# Altium schematic sheet [5] Charger.SchDoc: Charger
size A3; SheetNumber: 5; SheetTotal: 6
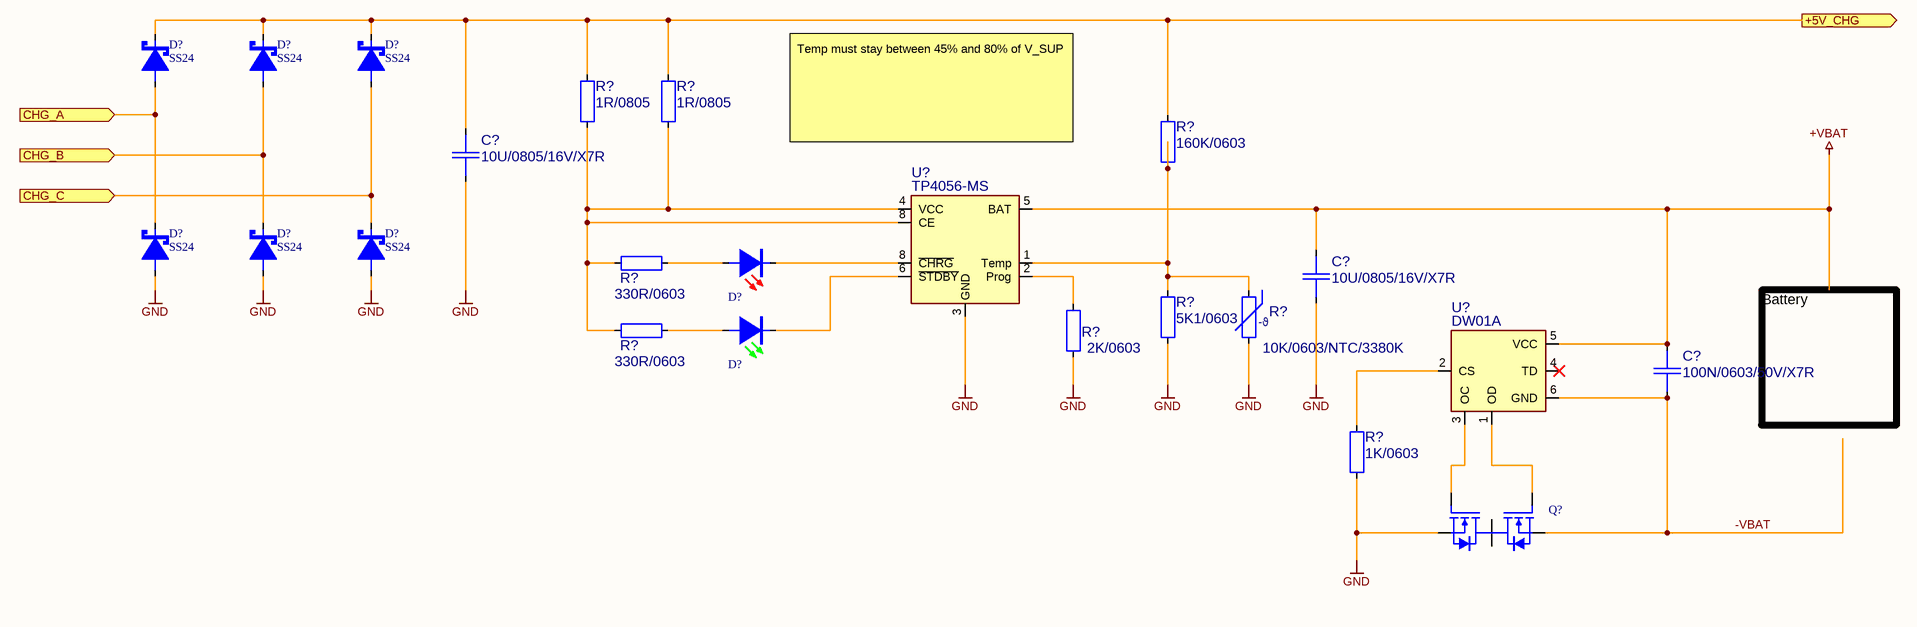
[diagram p0: [5] Charger.SchDoc]

## Parts
(Parts that share a designator on the sheet are numbered #1, #2 ... from top to bottom, then left to right.)
C?#1  10U/0805/16V/X7R  [CAP0805_X7R]
C?#2  10U/0805/16V/X7R  [CAP0805_X7R]
C?#3  100N/0603/50V/X7R  [CAP0603_X7R]
D?#1  SS24  [DIOM5226X230]
D?#2  SS24  [DIOM5226X230]
D?#3  SS24  [DIOM5226X230]
D?#4  SS24  [DIOM5226X230]
D?#5  SS24  [DIOM5226X230]
D?#6  SS24  [DIOM5226X230]
D?#7  LED Red  [LED0603_RED]  (value not drawn)
D?#8  LED Green  [LED0603_GREEN]  (value not drawn)
Q?  8205S  [SOT2395P280X125-3]  (value not drawn)
R?#1  1R/0805
R?#2  1R/0805
R?#3  160K/0603  [R0603-0.40-WW]
R?#4  330R/0603  [R0603-0.40-WW]
R?#5  5K1/0603  [R0603-0.40-WW]
R?#6  10K/0603/NTC/3380K  [R0603-0.40-WW]
R?#7  2K/0603  [R0603-0.40-WW]
R?#8  330R/0603  [R0603-0.40-WW]
R?#9  1K/0603
U?#1  TP4056-MS
U?#2  DW01A

## Ports
+5V_CHG (out), CHG_A (in), CHG_B (in), CHG_C (in)

## Nets
+VBAT: C?#2.1 C?#3.1 U?#1.5(BAT) U?#2.5(VCC)
GND: C?#1.2 C?#2.2 D?#4.2 D?#5.2 D?#6.2 Q?.1(SOURCE1) R?#5.2 R?#6.2 R?#7.2 R?#9.2 U?#1.3(GND)
+5V_CHG: C?#1.1 D?#1.1 D?#2.1 D?#3.1 R?#1.1 R?#2.1 R?#3.1 ; port +5V_CHG
-VBAT: C?#3.2 Q?.3(SOURCE2) U?#2.6(GND)
CHG_A: D?#1.2 D?#4.1 ; port CHG_A
CHG_B: D?#2.2 D?#5.1 ; port CHG_B
CHG_C: D?#3.2 D?#6.1 ; port CHG_C
NetD?#7_1: D?#7.1 U?#1.8(~{CHRG})
NetD?#7_2: D?#7.2 R?#4.2
NetD?#8_1: D?#8.1 U?#1.6(~{STDBY})
NetD?#8_2: D?#8.2 R?#8.2
NetQ?_4: Q?.4(GATE2) U?#2.1(OD)
NetQ?_6: Q?.6(GATE1) U?#2.3(OC)
NetR?#1_2: R?#1.2 R?#2.2 R?#4.1 R?#8.1 U?#1.4(VCC) U?#1.8(CE)
NetR?#3_2: R?#3.2 R?#5.1 R?#6.1 U?#1.1(Temp)
NetR?#7_1: R?#7.1 U?#1.2(Prog)
NetR?#9_1: R?#9.1 U?#2.2(CS)

Not connected (* = marked no-connect by the designer): Q? 5(DRAIN); U?#2 4(TD)*

## Notes on the sheet
- Temp must stay between 45% and 80% of V_SUP
- Battery
- Date:
- Size:
- A3
- Schema:
- Layout:
- (in symbol 10K/0603/NTC/3380K) -ϑ

## Library data of the parts
C?#1 C?#2 = 10U/0805/16V/X7R: CAP SM 0805 10uF 16V X7R; Manufacturer: GENERIC; Manufacturer 1: Cal-Chip Electronics, Inc.; Manufacturer Part Number 1: GMC21X7R106K16NT; Absolute Value: 1E-5; Part Number: 10U/0805/16V/X7R; Package: 805; Value: 10uF; HelpURL: https://88ce57.p3cdn1.secureserver.net/wp-content/uploads/2023/01/gmc_series-2.pdf; Supplier 1: Digi-Key; Supplier Part Number 1: 4713-GMC21X7R106K16NTCT-ND; Manufacturer 2: Samsung Electro-Mechanics; Manufacturer Part Number 2: CL21B106KOQNNNE; Supplier 2: Digi-Key; Supplier Part Number 2: 1276-2872-1-ND
C?#3 = 100N/0603/50V/X7R: CAP SM 0603 100nF 50V X7R; Manufacturer: GENERIC; Manufacturer 1: YAGEO; Manufacturer Part Number 1: CC0603KPX7R9BB104; Absolute Value: 1E-7; Part Number: 100N/0603/50V/X7R; Package: 603; Value: 100nF; HelpURL: https://www.yageo.com/upload/media/product/app/datasheet/mlcc/upy-gphc_x7r_6_3v-to-250v.pdf; Supplier 1: Digi-Key; Supplier Part Number 1: 311-3567-1-ND; Manufacturer 2: YAGEO; Manufacturer Part Number 2: CC0603MRX7R9BB104; Supplier 2: Digi-Key; Supplier Part Number 2: 311-4110-1-ND
D?#1-D?#6 = SS24: Si Shottky Diode 2A DO-214AC; Manufacturer: MSKSEMI; Manufacturer Part Number 1: SS24-MS; Absolute Value: 40V; Part Number: SS24; Package: DO-214AC, SMA; Value: SS24; HelpURL: https://datasheet.lcsc.com/lcsc/2202131930_MSKSEMI-SS24-MS_C2836395.pdf; Manufacturer 1: MSKSEMI; Supplier 1: LCSC.com; Supplier Part Number 1: C2836395; Manufacturer 2: ElecSuper; Manufacturer Part Number 2: SS24; Supplier 2: LCSC.com; Supplier Part Number 2: C7509566
D?#7 = LED Red: Generic LED Red; Manufacturer 1: Würth; Manufacturer Part Number 1: 150060RS75000; Part Number: LED Red; Manufacturer: GENERIC; Package: 603; Value: Red; Absolute Value: Red; HelpURL: https://www.we-online.com/katalog/datasheet/150060RS75000.pdf; Supplier 1: Digi-Key; Supplier Part Number 1: 732-4978-1-ND; Manufacturer 2: XINGLIGHT; Manufacturer Part Number 2: XL-1608SURC-06; Supplier 2: LCSC.com; Supplier Part Number 2: C965799
D?#8 = LED Green: Generic LED Green; Manufacturer 1: Würth; Manufacturer Part Number 1: 150060VS75000; Part Number: LED Green; Manufacturer: GENERIC; Package: 603; Value: Green; Absolute Value: Green; HelpURL: https://www.we-online.com/katalog/datasheet/150060VS75000.pdf; Supplier 1: Digi-Key; Supplier Part Number 1: 732-4980-1-ND; Manufacturer 2: XINGLIGHT; Manufacturer Part Number 2: XL-1608SYGC-06; Supplier 2: LCSC.com; Supplier Part Number 2: C965805
Q? = 8205S: Common Drain MOSFET; Manufacturer 1: JSMSEMI; Part Number: 8205S; Package: SET23-6; HelpURL: https://datasheet.lcsc.com/lcsc/2401050929_JSMSEMI-8205S_C2762930.pdf; Manufacturer Part Number 1: 8205S; Supplier 1: LCSC.com; Supplier Part Number 1: C2762930
R?#1 R?#2 R?#9 = R: Generic resistor symbol / European drawing style
R?#3 = 160K/0603: RES SM 0603 160K; Manufacturer: GENERIC; Manufacturer 1: YAGEO; Manufacturer Part Number 1: RC0603FR-13160KL; Absolute Value: 160000; Part Number: 160K/0603; Package: 0603; Value: 160K; HelpURL: https://www.yageo.com/upload/media/product/productsearch/datasheet/rchip/PYu-RC_Group_51_RoHS_L_12.pdf; Supplier 1: Digi-Key; Supplier Part Number 1: 13-RC0603FR-13160KLCT-ND; Manufacturer 2: YAGEO; Manufacturer Part Number 2: RC0603FR-07160KL; Supplier 2: Digi-Key; Supplier Part Number 2: 311-160KHRCT-ND
R?#4 R?#8 = 330R/0603: RES SM 0603 330R; Manufacturer: GENERIC; Manufacturer 1: YAGEO; Manufacturer Part Number 1: RC0603FR-13330RL; Absolute Value: 330; Part Number: 330R/0603; Package: 0603; Value: 330R; HelpURL: https://www.yageo.com/upload/media/product/app/datasheet/rchip/pyu-rc_group_51_rohs_l.pdf; Supplier 1: Digi-Key; Supplier Part Number 1: 13-RC0603FR-13330RLCT-ND; Manufacturer 2: YAGEO; Manufacturer Part Number 2: RC0603FR-10330RL; Supplier 2: Digi-Key; Supplier Part Number 2: 13-RC0603FR-10330RLCT-ND
R?#5 = 5K1/0603: RES SM 0603 5K1; Manufacturer: GENERIC; Manufacturer 1: YAGEO; Manufacturer Part Number 1: RC0603FR-135K1L; Absolute Value: 5100; Part Number: 5K1/0603; Package: 0603; Value: 5K1; HelpURL: https://www.yageo.com/upload/media/product/app/datasheet/rchip/pyu-rc_group_51_rohs_l.pdf; Supplier 1: Digi-Key; Supplier Part Number 1: 13-RC0603FR-135K1LCT-ND; Manufacturer 2: YAGEO; Manufacturer Part Number 2: RC0603FR-105K1L; Supplier 2: Digi-Key; Supplier Part Number 2: 13-RC0603FR-105K1LCT-ND
R?#6 = 10K/0603/NTC/3380K: RES NTC SM 0603 10K; Manufacturer: GENERIC; Manufacturer 1: Murata; Manufacturer Part Number 1: NCU18XH103E60RB; Absolute Value: 10000; Part Number: 10K/0603/NTC/3380K; Package: 603; Value: 10K; HelpURL: https://www.murata.com/en-us/api/pdfdownloadapi?cate=luNTCforTempeSenso&partno=NCU18XH103E60RB; Supplier 1: Digi-Key; Supplier Part Number 1: 490-18164-1-ND; Manufacturer 2: Sunlord; Manufacturer Part Number 2: SDNT1608X103F3380FTF; Supplier 2: LCSC.com; Supplier Part Number 2: C316397
R?#7 = 2K/0603: RES SM 0603 2K; Manufacturer: GENERIC; Manufacturer 1: YAGEO; Manufacturer Part Number 1: RC0603FR-132KL; Absolute Value: 2000; Part Number: 2K/0603; Package: 0603; Value: 2K; HelpURL: https://www.yageo.com/upload/media/product/app/datasheet/rchip/pyu-rc_group_51_rohs_l.pdf; Supplier 1: Digi-Key; Supplier Part Number 1: 13-RC0603FR-132KLCT-ND; Manufacturer 2: YAGEO; Manufacturer Part Number 2: RC0603FR-102KL; Supplier 2: Digi-Key; Supplier Part Number 2: 13-RC0603FR-102KLCT-ND
U?#1 = TP4056: 1A Standalone Linear Li-lon Battery Charger with Thermal / Regulation in SOP-8
U?#2 = DW01A: Single Cell Lithium-ion battery protection IC